# Altium schematic sheet AC_MOVE-V3.4.SchDoc
size A4
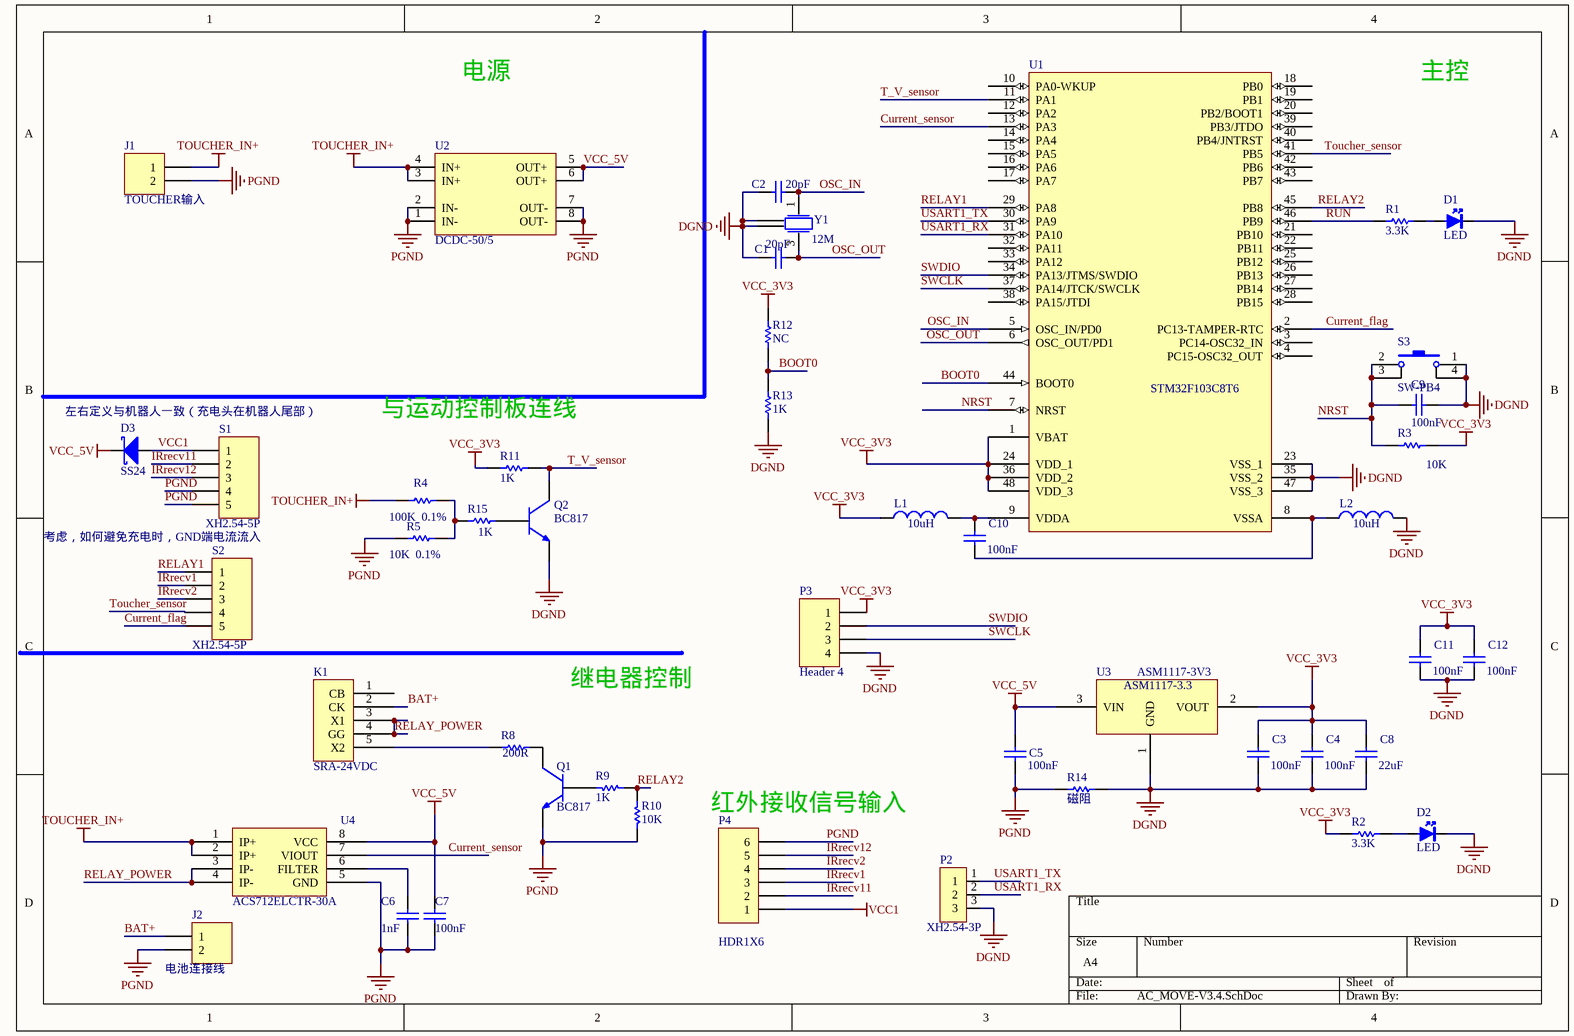
[diagram p0: AC_MOVE-V3.4.SchDoc]

## Parts
C1  20pF  [C0805]
C2  20pF  [C0805]
C3  value 100nF  [C0805]  (hidden comment: Cap)
C4  value 100nF  [C0805]  (hidden comment: Cap)
C5  value 100nF  [C0805]  (hidden comment: Cap)
C6  value 1nF  [C0805]  (hidden comment: Cap)
C7  value 100nF  [C0805]  (hidden comment: Cap)
C8  value 22uF  [C0805]  (hidden comment: Cap)
C9  value 100nF  [C0805]  (hidden comment: Cap)
C10  value 100nF  [C0805]  (hidden comment: Cap)
C11  value 100nF  [C0805]  (hidden comment: Cap)
C12  value 100nF  [C0805]  (hidden comment: Cap)
D1  LED  [LED0805]
D2  LED  [LED0805]
D3  value SS24  [D-SMA]  (hidden comment: Diode-Schottky)
J1  TOUCHER输入  [6-0805_M]
J2  电池连接线  [DIODE-AXL]
K1  SRA-24VDC  [SRD-05VDC]
L1  value 10uH  [R0805]  (hidden comment: Inductor)
L2  value 10uH  [R0805]  (hidden comment: Inductor)
P2  value XH2.54-3P  [XH2.54-3P]  (hidden comment: MCU)
P3  Header 4  [HDR1X4]
P4  value HDR1X6  [HDR1X6]  (hidden comment: Header 6)
Q1  BC817  [SOT-23_N]
Q2  BC817  [SOT-23_N]
R1  value 3.3K  [R0805]  (hidden comment: Res1)
R2  value 3.3K  [R0805]  (hidden comment: Res1)
R3  value 10K  [R0805]  (hidden comment: Res1)
R4  value 100K  0.1%  [R0805]  (hidden comment: Res1)
R5  value 10K  0.1%  [R0805]  (hidden comment: Res1)
R8  value 200R  [2512]  (hidden comment: Res1)
R9  value 1K  [R0805]  (hidden comment: Res1)
R10  value 10K  [R0805]  (hidden comment: Res1)
R11  value 1K  [R0805]  (hidden comment: Res1)
R12  value NC  [0805-1]  (hidden comment: Res1)
R13  value 1K  [R0805]  (hidden comment: Res1)
R14  value 磁阻  [0805-1]  (hidden comment: Res1)
R15  value 1K  [R0805]  (hidden comment: Res1)
S1  value XH2.54-5P  [XH2.54-5P]  (hidden comment: Header 5)
S2  value XH2.54-5P  [XH2.54-5P]  (hidden comment: Header 5)
S3  SW-PB4  [RESET-SMD-1O4]
U1  STM32F103C8T6  [LQFP48_N]
U2  DCDC-50/5  [DCDC50/5]
U3  ASM1117-3V3  [ASM1117-3V3]
U4  ACS712ELCTR-30A  [ACS712-SOIC8]
Y1  value 12M  [EPSON-16M]  (hidden comment: XTAL-4PIN)

## Nets
DGND: C1.2 C2.2 C3.1 C4.1 C8.1 C9.2 C11.1 C12.1 D1.2(K) D2.2(K) L2.2 P2.3 P3.4 Q2.2(E) R13.2 R14.1 S3.1 S3.4 U1.23(VSS_1) U1.35(VSS_2) U1.47(VSS_3) U3.1(GND) Y1.2 Y1.4
PGND: C5.1 C6.1 C7.1 J1.2 J2.2 P4.6 Q1.2(E) R5.1 R10.1 R14.2 S1.4 S1.5 U2.1(IN-) U2.2(IN-) U2.7(OUT-) U2.8(OUT-) U4.5(GND)
TOUCHER_IN+: J1.1 R4.1 U2.3(IN+) U2.4(IN+) U4.1(IP+) U4.2(IP+)
VCC1: D3.1(A) P4.1 S1.1
VCC_3V3: C3.2 C4.2 C8.2 C11.2 C12.2 L1.1 P3.1 R2.2 R3.2 R11.1 R12.2 U1.1(VBAT) U1.24(VDD_1) U1.36(VDD_2) U1.48(VDD_3) U3.2(VOUT)
VCC_5V: C5.2 C7.2 D3.2(K) U2.5(OUT+) U2.6(OUT+) U3.3(VIN) U4.8(VCC)
BAT+: J2.1 K1.2(CK)
BOOT0: R12.1 R13.1 U1.44(BOOT0)
Current_flag: S2.5 U1.2(PC13-TAMPER-RTC)
Current_sensor: U1.13(PA3) U4.7(VIOUT)
IRrecv1: P4.3 S2.2
IRrecv2: P4.4 S2.3
IRrecv11: P4.2 S1.2
IRrecv12: P4.5 S1.3
NRST: C9.1 R3.1 S3.2 S3.3 U1.7(NRST)
OSC_IN: C2.1 U1.5(OSC_IN/PD0) Y1.1
OSC_OUT: C1.1 U1.6(OSC_OUT/PD1) Y1.3
RELAY1: S2.1 U1.29(PA8)
RELAY2: R9.2 R10.2 U1.45(PB8)
RELAY_POWER: K1.3(X1) K1.4(GG) U4.3(IP-) U4.4(IP-)
RUN: R1.2 U1.46(PB9)
SWCLK: P3.3 U1.37(PA14/JTCK/SWCLK)
SWDIO: P3.2 U1.34(PA13/JTMS/SWDIO)
T_V_sensor: Q2.3(C) R11.2 U1.11(PA1)
Toucher_sensor: S2.4 U1.41(PB5)
USART1_RX: P2.2 U1.31(PA10)
USART1_TX: P2.1 U1.30(PA9)
NetC6_2: C6.2 U4.6(FILTER)
NetC10_1: C10.1 L2.1 U1.8(VSSA)
NetC10_2: C10.2 L1.2 U1.9(VDDA)
NetD1_1: D1.1(A) R1.1
NetD2_1: D2.1(A) R2.1
NetK1_5: K1.5(X2) R8.2
NetQ1_1: Q1.1(B) R9.1
NetQ1_3: Q1.3(C) R8.1
NetQ2_1: Q2.1(B) R15.2
NetR4_2: R4.2 R5.2 R15.1

Not connected (* = marked no-connect by the designer): K1 1(CB); U1 3(PC14-OSC32_IN) 4(PC15-OSC32_OUT) 10(PA0-WKUP) 12(PA2) 14(PA4) 15(PA5) 16(PA6) 17(PA7) 18(PB0) 19(PB1) 20(PB2/BOOT1) 21(PB10) 22(PB11) 25(PB12) 26(PB13) 27(PB14) 28(PB15) 32(PA11) 33(PA12) 38(PA15/JTDI) 39(PB3/JTDO) 40(PB4/JNTRST) 42(PB6) 43(PB7)

## Notes on the sheet
- 电源
- 主控
- 左右定义与机器人一致（充电头在机器人尾部）
- 与运动控制板连线
- 考虑，如何避免充电时，GND端电流流入
- 继电器控制
- (near P4) 红外接收信号输入
- (in symbol ASM1117-3V3) ASM1117-3.3

## Library data of the parts
C1-C12 = Cap: Capacitor; Published: 8-Jun-2000; LatestRevisionDate: 17-Jul-2002; LatestRevisionNote: Re-released for DXP Platform.; PackageReference: RAD-0.3; Publisher: Altium Limited; PackageDescription: Radial Cap, Thru-Hole; 2 Leads; 0.3 in Pin Spacing
  C1 C2: Value: 20pF
D1 D2 = LED: Value: LED-H-R2.54
D3 = Diode-Schottky: 肖特基二极管; Published: 8-Jun-2000; LatestRevisionDate: 17-Jul-2002; LatestRevisionNote: Re-released for DXP Platform.; PackageReference: SMB; Publisher: Altium Limited; Code_JEDEC: DO-214-AA
J1 J2 = Header 2: Header, 2-Pin; Value: T_X60; LatestRevisionDate: 17-Jul-2002; LatestRevisionNote: Re-released for DXP Platform.; Publisher: Altium Limited
K1 = SRD-05VDC
L1 L2 = Inductor: Code_IEC: 1005; Published: 8-Jun-2000; LatestRevisionDate: 29-May-2009; LatestRevisionNote: IPC-7351 Footprint Added.; PackageReference: 0402-A; Publisher: Altium Limited; PackageDescription: Chip Inductor; Code_JEITA: 0402
P2 = Conn_1*3
P3 = Header 4: Header, 4-Pin; LatestRevisionDate: 17-Jul-2002; LatestRevisionNote: Re-released for DXP Platform.; Publisher: Altium Limited
P4 = Header 6: Header, 6-Pin; LatestRevisionDate: 17-Jul-2002; LatestRevisionNote: Re-released for DXP Platform.; Publisher: Altium Limited
Q1 Q2 = mNPN: NPN 45V 功耗 310mW; Value: BC817
R1-R5 R8-R15 = Res1: Resistor; Published: 8-Jun-2000; LatestRevisionDate: 17-Jul-2002; LatestRevisionNote: Re-released for DXP Platform.; PackageReference: AXIAL-0.3; Publisher: Altium Limited; PackageDescription: Axial Device, Thru-Hole; 2 Leads; 0.3 in Pin Spacing
S1 S2 = Header 5: Header, 5-Pin; LatestRevisionDate: 17-Jul-2002; LatestRevisionNote: Re-released for DXP Platform.; Publisher: Altium Limited
S3 = SW-PB4: 微动开关; Published: 24-Mar-1999; LatestRevisionDate: 17-Jul-2002; LatestRevisionNote: Re-released for DXP Platform.; PackageReference: SPST-2; Publisher: Altium Limited
U1 = STM32F103C8T6: STM32 ARM-based 32-bit MCU with 64 Kbytes Flash, 48-pin LQFP, Industrial Temperature; Published: 30-May-2008; DatasheetVersion: rev6, Mar-2008; PackageVersion: Mar-2008; PackageReference: LQFP48; Publisher: Altium Limited; PackageDescription: 48-Pin Low-Profile Quad Flat Pack, 7 x 7 mm Body, 0.5 mm Pitch (LQFP48); ComponentLink1Description: Manufacturer Link; ComponentLink1URL: www.st.com/stm32; ComponentLink2Description: Datasheet; ComponentLink2URL: http://www.st.com/stonline/products/literature/ds/13587.pdf
U4 = ACS712: value: ACS712ELCTR-30A
U2 = DCDC-50/5: Value: DCDC-50/5